# EAGLE design 8channelsULN2803 (EAGLE 6.1)
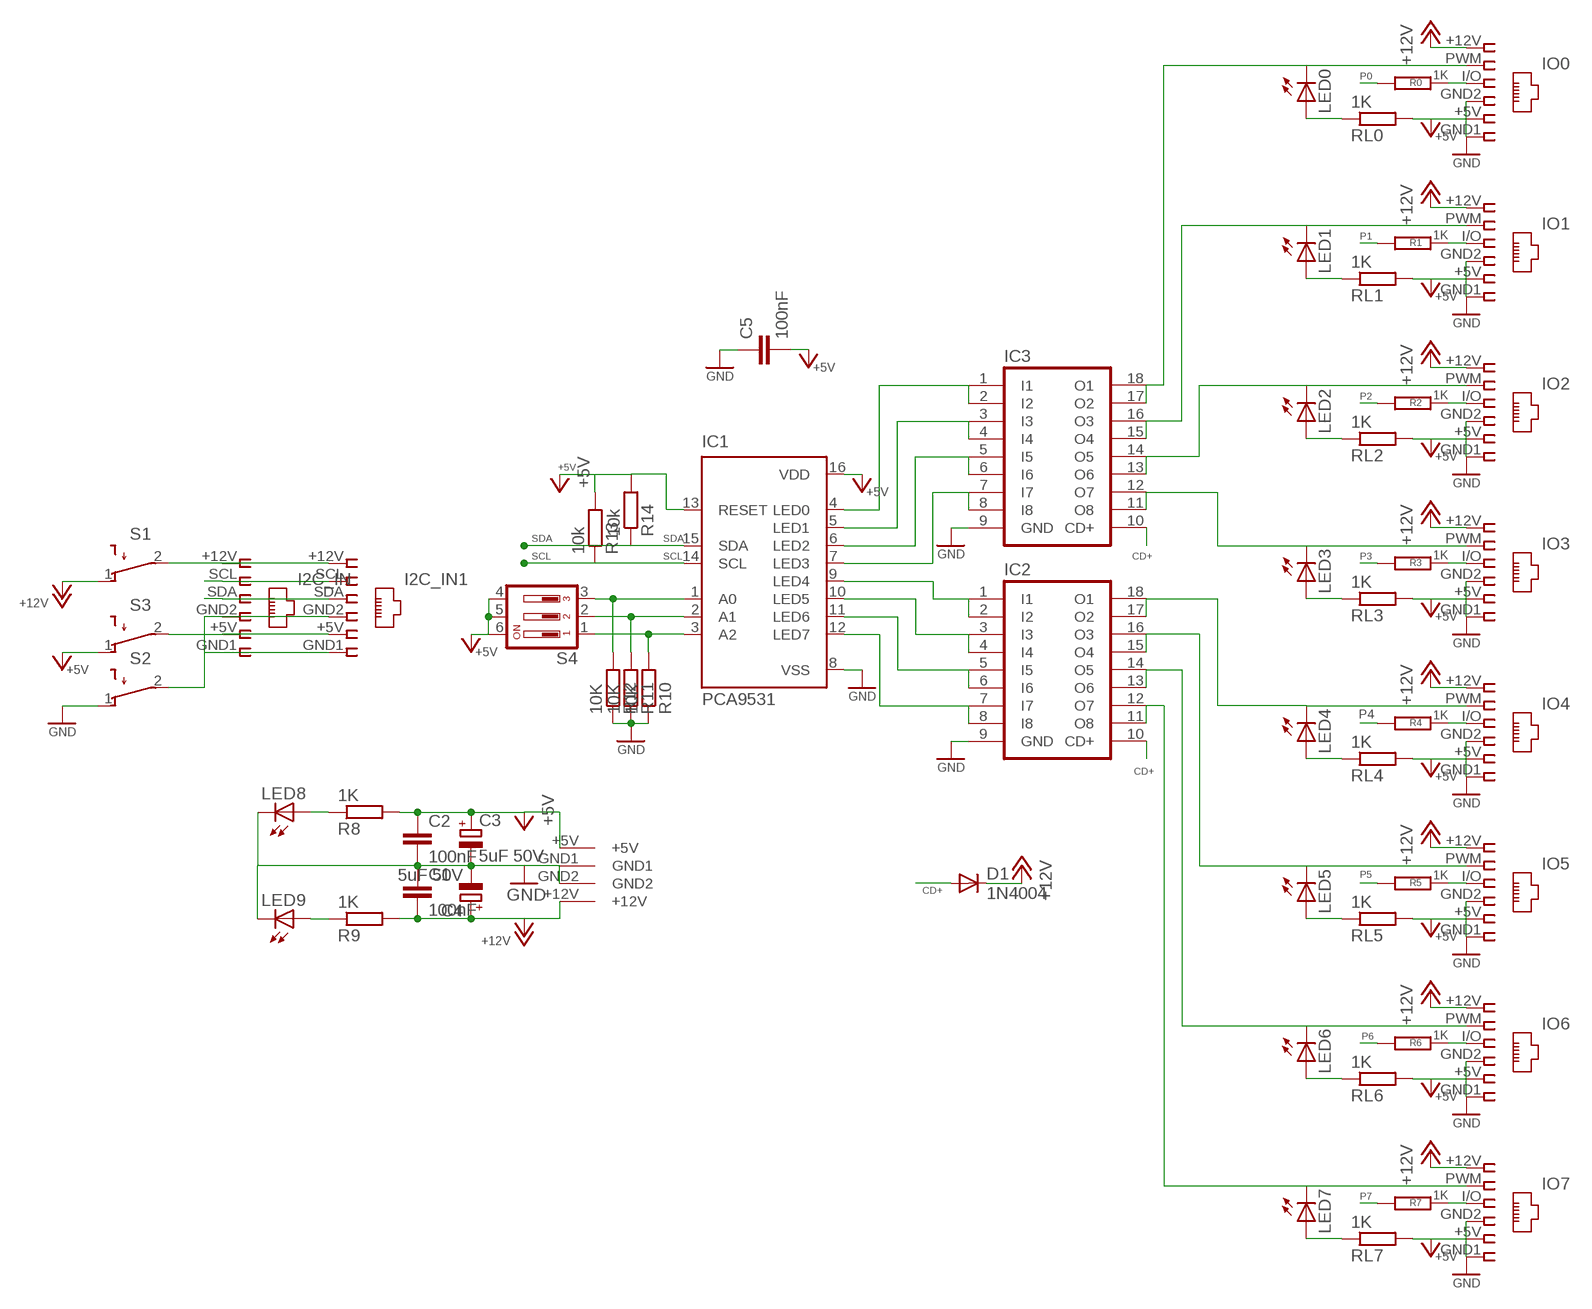
[diagram p0: schematic, sheet 1]

## Parts
C1  100nF  C-EUC1206  [C1206]
C2  100nF  C-EUC1206  [C1206]
C3  5uF 50V  CPOL-EUE3.5-8  [E3,5-8]
C4  5uF 50V  CPOL-EUE3.5-8  [E3,5-8]
C5  100nF  C-EUC1206  [C1206]
D1  1N4004  [DO41-10]
I2C_IN  I2C 1  RJ12STRAIGHT-I2C  [RJ12-STRAIGHT-I2C]
I2C_IN1  I2C 2  RJ12STRAIGHT-I2C  [RJ12-STRAIGHT-I2C]
IC1  PCA9531  [SO16]
IC2  ULN2803A  [DIL18]
IC3  ULN2803A  [DIL18]
IO0  IO0  RJ12STRAIGHT  [RJ12-STRAIGHT]
IO1  IO1  RJ12STRAIGHT  [RJ12-STRAIGHT]
IO2  IO2  RJ12STRAIGHT  [RJ12-STRAIGHT]
IO3  IO3  RJ12STRAIGHT  [RJ12-STRAIGHT]
IO4  IO4  RJ12STRAIGHT  [RJ12-STRAIGHT]
IO5  IO5  RJ12STRAIGHT  [RJ12-STRAIGHT]
IO6  IO6  RJ12STRAIGHT  [RJ12-STRAIGHT]
IO7  IO7  RJ12STRAIGHT  [RJ12-STRAIGHT]
LED0  LED3MM  [LED3MM]
LED1  LED3MM  [LED3MM]
LED2  LED3MM  [LED3MM]
LED3  LED3MM  [LED3MM]
LED4  LED3MM  [LED3MM]
LED5  LED3MM  [LED3MM]
LED6  LED3MM  [LED3MM]
LED7  LED3MM  [LED3MM]
LED8  LED3MM  [LED3MM]
LED9  LED3MM  [LED3MM]
R0  1K  R-EU_M1206  [M1206]
R1  1K  R-EU_M1206  [M1206]
R2  1K  R-EU_M1206  [M1206]
R3  1K  R-EU_M1206  [M1206]
R4  1K  R-EU_M1206  [M1206]
R5  1K  R-EU_M1206  [M1206]
R6  1K  R-EU_M1206  [M1206]
R7  1K  R-EU_M1206  [M1206]
R8  1K  R-EU_M1206  [M1206]
R9  1K  R-EU_M1206  [M1206]
R10  10K  R-EU_M1206  [M1206]
R11  10K  R-EU_M1206  [M1206]
R12  10K  R-EU_M1206  [M1206]
R13  10k  R-EU_M1206  [M1206]
R14  10k  R-EU_M1206  [M1206]
RL0  1K  R-EU_M1206  [M1206]
RL1  1K  R-EU_M1206  [M1206]
RL2  1K  R-EU_M1206  [M1206]
RL3  1K  R-EU_M1206  [M1206]
RL4  1K  R-EU_M1206  [M1206]
RL5  1K  R-EU_M1206  [M1206]
RL6  1K  R-EU_M1206  [M1206]
RL7  1K  R-EU_M1206  [M1206]
S1  SWITCHSWITCH  [SWITCH2]
S2  SWITCHPAD  [PADS2]
S3  SWITCHSWITCH  [SWITCH2]
S4  DIP03YL  [DIP03YL]
U$2  KPJX-4S-S  [KPJX-4S-S]

## Nets
+5V [highpower]: C2.1 C3.+ C5.2 IC1.13(RESET) IC1.16(VDD) IO0.+5V IO1.+5V IO2.+5V IO3.+5V IO4.+5V IO5.+5V IO6.+5V IO7.+5V R8.2 R13.2 R14.2 RL0.2 RL1.2 RL2.2 RL3.2 RL4.2 RL5.2 RL6.2 RL7.2 S3.1(O) S4.4 S4.5 S4.6 U$2.+5V
+12V [highpower]: C1.2 C4.+ D1.C IO0.+12V IO1.+12V IO2.+12V IO3.+12V IO4.+12V IO5.+12V IO6.+12V IO7.+12V R9.2 S1.1(O) U$2.+12V
CD+: D1.A IC2.10(CD+) IC3.10(CD+)
D2B: IO4.I/O R4.1
D2B1: IO5.I/O R5.1
D2B2: IO6.I/O R6.1
D2B3: IO7.I/O R7.1
D2B4: IO0.I/O R0.1
D2B5: IO1.I/O R1.1
D2B6: IO2.I/O R2.1
D2B7: IO3.I/O R3.1
GND [highpower]: C1.1 C2.2 C3.- C4.- C5.1 IC1.8(VSS) IC2.9(GND) IC3.9(GND) IO0.GND1 IO0.GND2 IO1.GND1 IO1.GND2 IO2.GND1 IO2.GND2 IO3.GND1 IO3.GND2 IO4.GND1 IO4.GND2 IO5.GND1 IO5.GND2 IO6.GND1 IO6.GND2 IO7.GND1 IO7.GND2 LED8.K(C) LED9.K(C) R10.1 R11.1 R12.1 S2.1(O) U$2.GND1 U$2.GND2
N$1 [power]: IC3.15(O4) IC3.16(O3) IO1.PWM LED1.K(C)
N$2: LED0.A RL0.1
N$3 [power]: IC3.17(O2) IC3.18(O1) IO0.PWM LED0.K(C)
N$4: LED1.A RL1.1
N$5 [highpower]: I2C_IN1.+12V I2C_IN.+12V S1.2(P)
N$6 [power]: IC2.13(O6) IC2.14(O5) IO6.PWM LED6.K(C)
N$7 [highpower]: I2C_IN1.+5V I2C_IN.+5V S3.2(P)
N$8 [power]: IC2.17(O2) IC2.18(O1) IO4.PWM LED4.K(C)
N$9 [power]: IC3.11(O8) IC3.12(O7) IO3.PWM LED3.K(C)
N$10 [highpower]: I2C_IN1.GND1 I2C_IN1.GND2 I2C_IN.GND1 I2C_IN.GND2 S2.2(P)
N$12: LED5.A RL5.1
N$13: LED9.A R9.1
N$15: LED4.A RL4.1
N$16: IC1.1(A0) R12.2 S4.3
N$17: IC1.2(A1) R11.2 S4.2
N$18: IC1.3(A2) R10.2 S4.1
N$21: LED6.A RL6.1
N$23: LED8.A R8.1
N$28: LED7.A RL7.1
N$38: LED2.A RL2.1
N$40 [power]: IC3.13(O6) IC3.14(O5) IO2.PWM LED2.K(C)
N$41: LED3.A RL3.1
N$42 [power]: IC2.15(O4) IC2.16(O3) IO5.PWM LED5.K(C)
N$44 [power]: IC2.11(O8) IC2.12(O7) IO7.PWM LED7.K(C)
P0: IC1.4(LED0) IC3.1(I1) IC3.2(I2) R0.2
P1: IC1.5(LED1) IC3.3(I3) IC3.4(I4) R1.2
P2: IC1.6(LED2) IC3.5(I5) IC3.6(I6) R2.2
P3: IC1.7(LED3) IC3.7(I7) IC3.8(I8) R3.2
P4: IC1.9(LED4) IC2.1(I1) IC2.2(I2) R4.2
P5: IC1.10(LED5) IC2.3(I3) IC2.4(I4) R5.2
P6: IC1.11(LED6) IC2.5(I5) IC2.6(I6) R6.2
P7: IC1.12(LED7) IC2.7(I7) IC2.8(I8) R7.2
SCL: I2C_IN1.SCL I2C_IN.SCL IC1.14(SCL) R13.1
SDA: I2C_IN1.SDA I2C_IN.SDA IC1.15(SDA) R14.1

## Library data of the parts
C1 C2 C5 = rcl:C-EU: CAPACITOR, European symbol
C3 C4 = rcl:CPOL-EU: POLARIZED CAPACITOR, European symbol
D1 = diode:1N4004: DIODE general purpose rectifier, 1 A
I2C_IN I2C_IN1 IO0 IO1-IO7 = lpatiny:RJ12: CORCOM Modular RJ Jacks No Shield Source: www.tycoelectronics.com .. ENG_DS_1654001_1099_RJ_L_0507.pdf
IC1 = lpatiny:PCA9531: I2C-Bus 8-bit LED dimmer r http://www.nxp.com/documents/data_sheet/PCA9531.pdf
IC2 IC3 = uln-udn:ULN2803A: DRIVER ARRAY
LED0 LED1-LED9 = lpatiny:LED3MM
R0 R1-R14 RL0 RL1-RL7 = resistor:R-EU_: RESISTOR, European symbol
S1-S3 = lpatiny:SWITCH: TOGGLE SWITCH
S4 = switch-dil:DIP03YL: DIL/CODE SWITCH; OC_FARNELL: unknown; OC_NEWARK: unknown
U$2 = lpatiny:KPJX-4S-S

## Net classes
0 default: width 0.457 mm
1 power: width 0.914 mm
2 highpower: width 1.372 mm

## Board
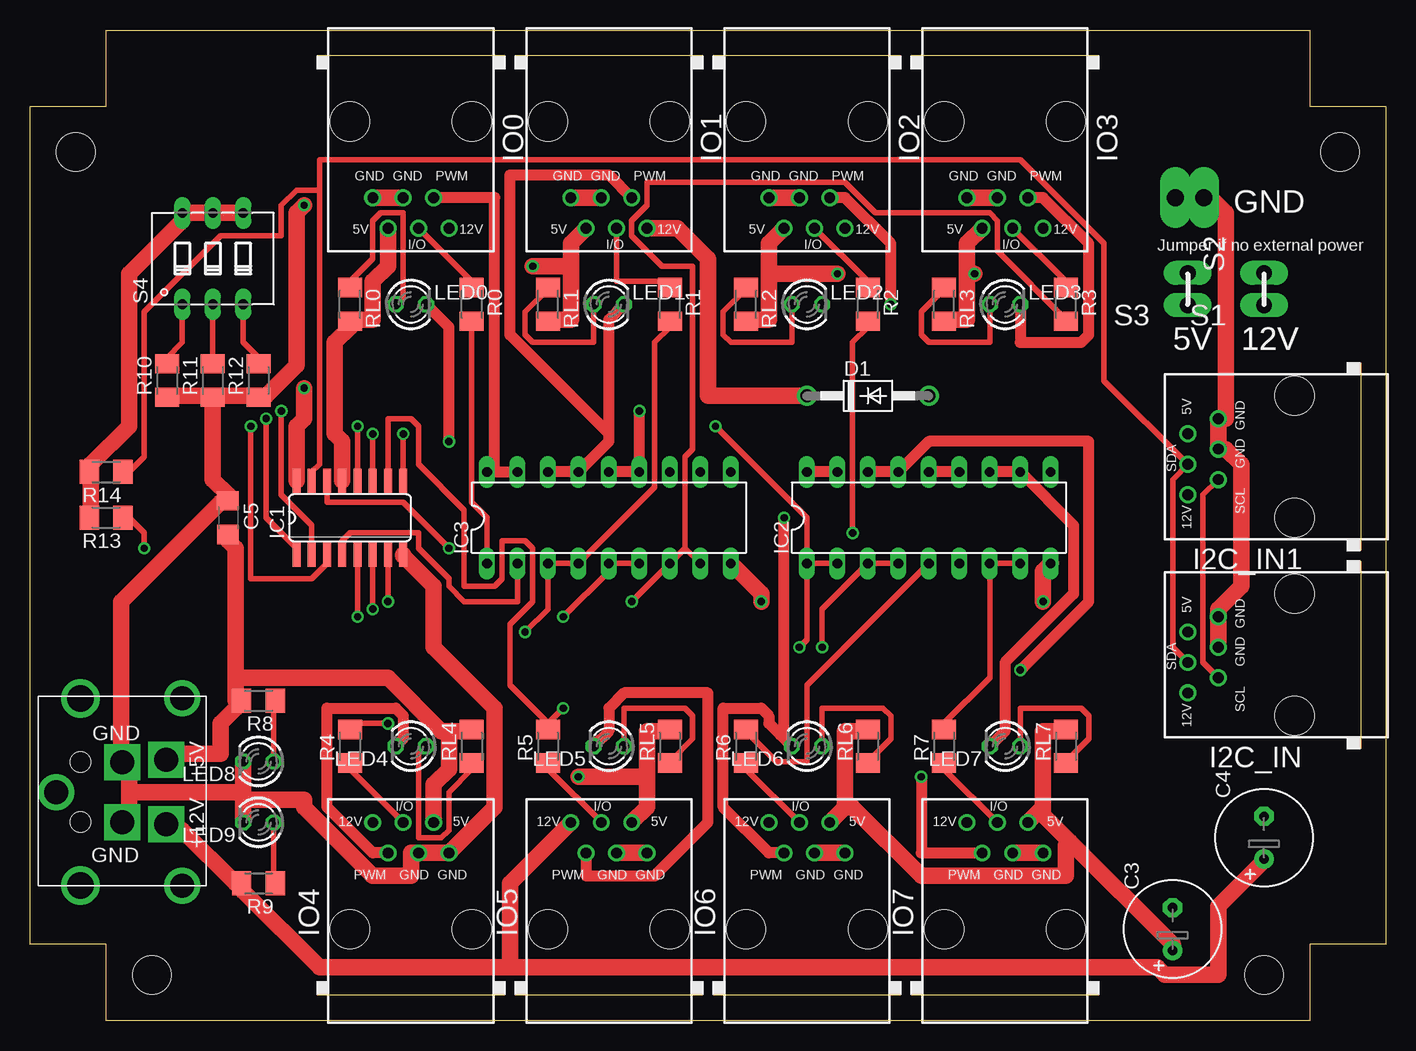
[diagram p1: board, top side]
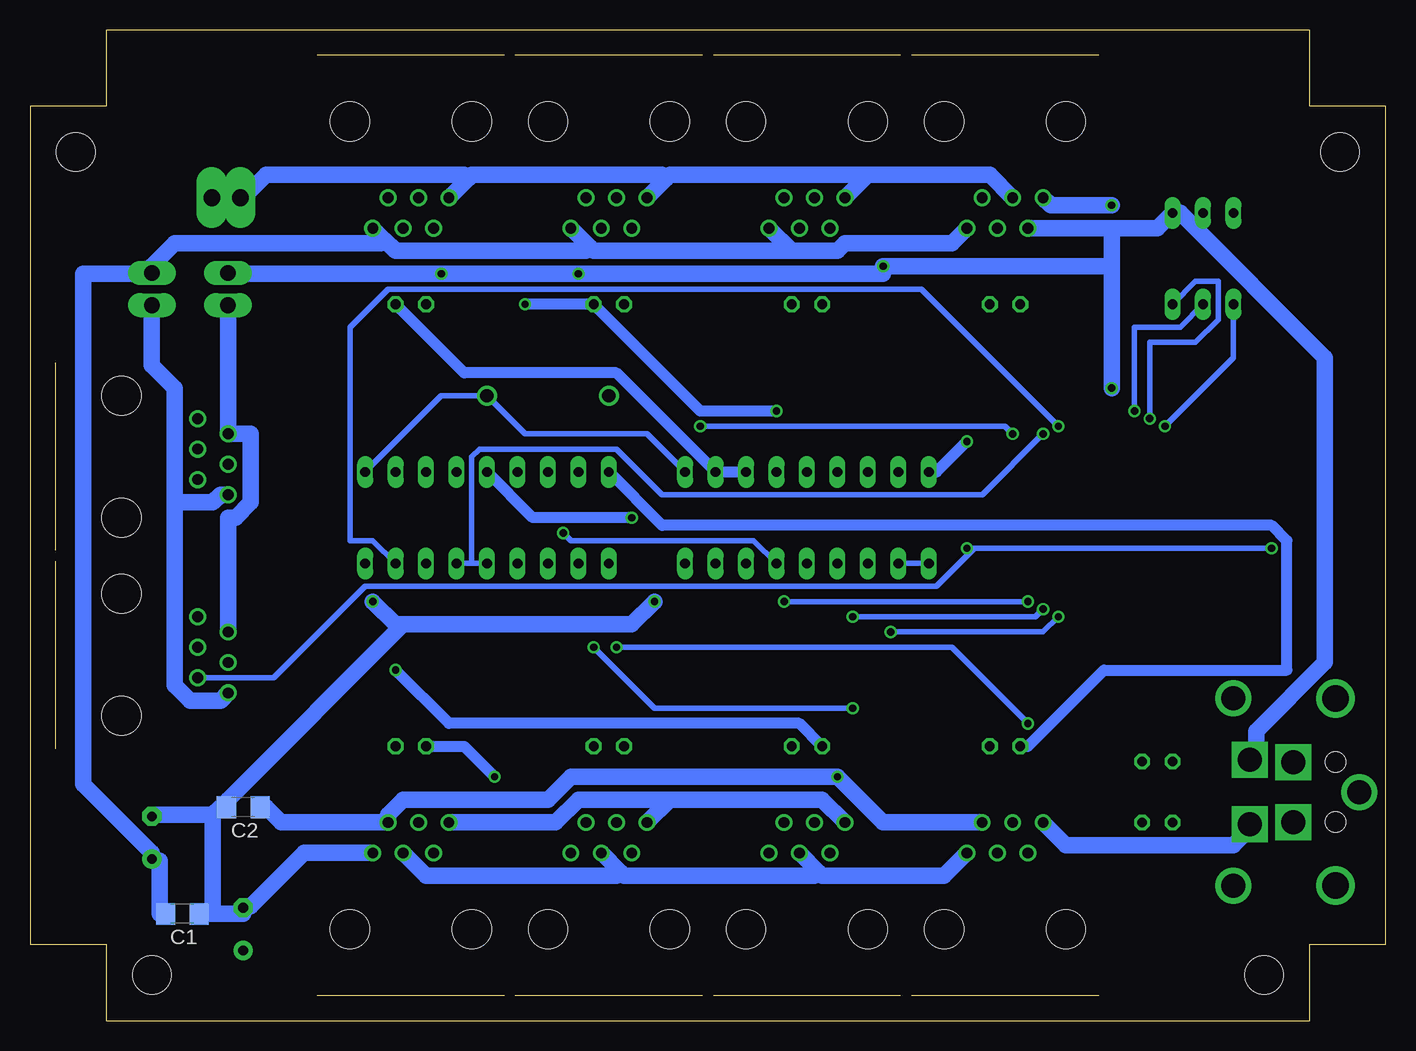
[diagram p2: board, bottom side, seen from below]

Size 113.03 x 82.55 mm. Coordinates in mm from the lower left corner, seen from the top.
Outline: 0,76.2 6.35,76.2 6.35,82.55 106.68,82.55 106.68,76.2 113.03,76.2 113.03,6.35 106.68,6.35 106.68,0 6.35,0 6.35,6.35 0,6.35 0,76.2
Copper layers (1*16): Top 0.035mm / dielectric 1.5mm / Bottom 0.035mm
Design rules: minimum track width 10mil, minimum drill 24mil, track to track 8mil, track to pad 8mil, pad to pad 8mil, via to via 8mil, smd to smd 8mil, copper to edge 40mil, drill to drill 8mil, minimum pad ring 10mil, minimum via ring 8mil, stop-mask expansion 4mil, vias tented up to drill 0mil, thermal gap 10mil
Holes 3.2 mm at 3.81,72.39 10.16,3.81 102.87,3.81 109.22,72.39
vRestrict: area 20.3,35.6 to 34.3,48.3
Milling: 12 lines

### Footprints (pad centres in the part's own frame; a part is rotated, then mirrored left to right if it is on the bottom)
C1206 = smd 1.6 x 1.8: 1 -1.4,0; 2 1.4,0
E3,5-8 = drill 0.813 pad 1.6: + -1.778,0 | drill 0.813 pad 1.6 octagon: - 1.778,0
DO41-10 = drill 1.118: A 5.08,0; C -5.08,0
RJ12-STRAIGHT-I2C = drill 0.9 pad 1.4: +5V 1.905,8.89; +12V -3.175,8.89; GND1 3.175,6.35; GND2 0.635,6.35; SCL -1.905,6.35; SDA -0.635,8.89 | hole 3.251: -5.08,0; 5.08,0
SO16 = smd 0.66 x 2.032: 1 -4.445,-3.073; 2 -3.175,-3.073; 3 -1.905,-3.073; 4 -0.635,-3.073; 5 0.635,-3.073; 6 1.905,-3.073; 7 3.175,-3.073; 8 4.445,-3.073; 9 4.445,3.073; 10 3.175,3.073; 11 1.905,3.073; 12 0.635,3.073; 13 -0.635,3.073; 14 -1.905,3.073; 15 -3.175,3.073; 16 -4.445,3.073
DIL18 = drill 0.813 long: 1 -10.16,-3.81; 2 -7.62,-3.81; 3 -5.08,-3.81; 4 -2.54,-3.81; 5 0,-3.81; 6 2.54,-3.81; 7 5.08,-3.81; 8 7.62,-3.81; 9 10.16,-3.81; 10 10.16,3.81; 11 7.62,3.81; 12 5.08,3.81; 13 2.54,3.81; 14 0,3.81; 15 -2.54,3.81; 16 -5.08,3.81; 17 -7.62,3.81; 18 -10.16,3.81
RJ12-STRAIGHT = drill 0.9 pad 1.4: +5V 1.905,8.89; +12V -3.175,8.89; GND1 3.175,6.35; GND2 0.635,6.35; I/O -0.635,8.89; PWM -1.905,6.35 | hole 3.251: -5.08,0; 5.08,0
LED3MM = drill 0.813 octagon: A -1.27,0; K 1.27,0
M1206 = smd 1.6 x 2: 1 -1.4,0; 2 1.4,0
SWITCH2 = drill 1.3 pad 2 long: 1 0,-1.346; 2 0,1.346
PADS2 = drill 1.4 pad 2.54 long: 1 0,-1.029; 2 0,1.346
DIP03YL = drill 0.813 long: 1 -2.54,-3.81; 2 0,-3.81; 3 2.54,-3.81; 4 2.54,3.81; 5 0,3.81; 6 -2.54,3.81
KPJX-4S-S = drill 2 square: +5V 2.7,1.35; +12V -2.7,1.35; GND1 -2.5,5; GND2 2.5,5 | drill 2: P$1 -7.8,0; P$2 7.8,0; P$11 0,10.5 | drill 2.2: P$3 -7.8,8.5; P$4 7.8,8.5 | hole 1.7: -2.5,8.5; 2.5,8.5

### Placement (x,y rotation side)
C1  100.33,8.89 180 bottom
C2  95.25,17.78 180 bottom
C3  95.25,7.62 90 top
C4  102.87,15.24 90 top
C5  16.51,41.91 270 top
D1  69.85,52.07 0 top
I2C_IN  105.41,30.48 90 top
I2C_IN1  105.41,46.99 90 top
IC1  26.67,41.91 0 top
IC2  74.93,41.91 0 top
IC3  48.26,41.91 0 top
IO0  31.75,74.93 180 top
IO1  48.26,74.93 180 top
IO2  64.77,74.93 180 top
IO3  81.28,74.93 180 top
IO4  31.75,7.62 0 top
IO5  48.26,7.62 0 top
IO6  64.77,7.62 0 top
IO7  81.28,7.62 0 top
LED0  31.75,59.69 0 top
LED1  48.26,59.69 0 top
LED2  64.77,59.69 0 top
LED3  81.28,59.69 0 top
LED4  31.75,22.86 180 top
LED5  48.26,22.86 180 top
LED6  64.77,22.86 180 top
LED7  81.28,22.86 180 top
LED8  19.05,21.59 180 top
LED9  19.05,16.51 180 top
R0  36.83,59.69 270 top
R1  53.34,59.69 270 top
R2  69.85,59.69 270 top
R3  86.36,59.69 270 top
R4  26.67,22.86 90 top
R5  43.18,22.86 90 top
R6  59.69,22.86 90 top
R7  76.2,22.86 90 top
R8  19.05,26.67 180 top
R9  19.05,11.43 180 top
R10  11.43,53.34 90 top
R11  15.24,53.34 90 top
R12  19.05,53.34 90 top
R13  6.35,41.91 180 top
R14  6.35,45.72 180 top
RL0  26.67,59.69 270 top
RL1  43.18,59.69 270 top
RL2  59.69,59.69 270 top
RL3  76.2,59.69 270 top
RL4  36.83,22.86 90 top
RL5  53.34,22.86 90 top
RL6  69.85,22.86 90 top
RL7  86.36,22.86 90 top
S1  102.87,60.96 180 top
S2  96.52,68.58 270 top
S3  96.52,60.96 180 top
S4  15.24,63.5 0 top
U$2  12.7,19.05 90 top

### Tracks (layer width: path | path; a pad name or v marks a point on that pad's centre or on a via)
+5V  (via drill 0.61)
  Top 1.372: 61.6,62.23 61.6,64.77 IO2.+5V | 61.6,62.23 61.6,58.42 59.69,58.42 RL2.2 | 78.1,62.23 78.1,64.77 IO3.+5V | 78.1,62.23 78.1,58.42 76.2,58.42 RL3.2 | v78.74,62.23 78.1,62.23 | v67.31,62.23 61.6,62.23 | R13.2 5.08,41.91 5.08,45.72 R14.2 5.08,46.35 8.26,49.53 8.26,62.23 12.7,66.67 S4.6 S4.5 S4.4 | 45.09,62.87 45.09,64.77 IO1.+5V | 45.09,62.87 45.09,58.42 43.18,58.42 RL1.2 | IO0.+5V 29.84,62.87 28.57,61.59 28.57,58.42 26.67,58.42 RL0.2 26.67,57.78 25.4,56.52 25.4,48.9 26.04,48.26 IC1.13 | IC1.16 22.22,49.53 22.86,50.16 v22.86,52.7 | v41.91,62.87 45.09,62.87 | 67.94,17.78 67.94,24.13 69.85,24.13 RL6.2 | IO6.+5V 67.94,17.78 | 84.45,17.78 84.45,24.13 86.36,24.13 RL7.2 | IO7.+5V 84.45,17.78 | 86.68,14.92 84.45,17.14 84.45,17.78 | 86.68,14.92 95.25,6.35 C3.+ | 67.94,17.78 68.58,17.78 74.3,12.06 86.36,12.06 86.36,14.61 86.68,14.92 | 51.44,20.32 51.44,17.78 IO5.+5V | 51.44,20.32 51.44,24.13 53.34,24.13 RL5.2 | 34.93,24.13 36.83,24.13 RL4.2 | 34.93,24.13 34.93,20.95 33.66,19.68 IO4.+5V | 17.14,28.57 17.14,26.67 R8.2 17.14,26.04 15.88,24.77 15.88,22.23 11.43,22.23 U$2.+5V | 17.14,28.57 17.14,39.37 16.51,40.01 C5.2 | 17.14,28.57 29.84,28.57 34.29,24.13 34.93,24.13 | v45.72,20.32 51.44,20.32
  Bottom 1.372: S3.1 96.52,62.23 v78.74,62.23 v67.31,62.23 41.91,62.23 v41.91,62.87 22.86,62.87 | 22.86,66.04 22.86,62.87 | 22.86,62.87 v22.86,52.7 | IO0.+5V 22.86,66.04 | 22.86,66.04 19.05,66.04 S4.4 17.14,67.31 5.08,55.24 5.08,29.84 10.79,24.13 10.79,22.23 U$2.+5V | C2.1 93.34,17.78 92.08,16.51 IO7.+5V 83.19,17.14 81.91,18.41 69.85,18.41 67.94,20.32 v45.72,20.32 41.91,16.51 IO4.+5V
+12V
  Top 1.372: U$2.+12V 11.43,15.88 12.7,15.88 17.14,11.43 R9.2 17.78,10.79 24.13,4.45 40.01,4.45 | 40.01,4.45 40.01,11.43 IO5.+12V | D1.C 56.52,52.07 56.52,63.5 53.98,66.04 IO1.+12V | 40.01,4.45 93.98,4.45 94.61,3.81 99.06,3.81 99.06,9.53 102.87,13.34 C4.+
  Bottom 1.372: IO4.+12V 26.67,14.61 12.7,14.61 11.43,15.88 U$2.+12V | IO5.+12V 46.99,18.41 59.69,18.41 | IO6.+12V 59.69,18.41 | IO7.+12V 69.21,16.51 67.31,18.41 59.69,18.41 | C1.2 102.23,8.89 102.23,13.34 102.87,13.34 C4.+ 102.87,13.97 108.58,19.68 108.58,62.23 103.5,62.23 S1.1 102.87,62.87 100.96,64.77 83.82,64.77 83.5,65.09 | IO0.+12V 36.2,64.77 45.09,64.77 45.72,64.14 49.53,64.14 | IO1.+12V 49.53,64.14 | 66.36,64.45 66.04,64.14 49.53,64.14 | 66.36,64.45 IO2.+12V | 83.5,65.09 82.55,64.14 66.67,64.14 66.36,64.45 | 83.5,65.09 IO3.+12V
CD+
  Bottom 0.457: IC3.10 61.6,48.9 71.75,48.9 D1.A 78.74,52.07 IC2.10
D2B
  Top 0.457: IO4.I/O 26.67,20.95 R4.1
D2B1
  Top 0.457: IO5.I/O 43.18,20.95 R5.1
D2B2
  Top 0.457: IO6.I/O 59.69,20.95 R6.1
D2B3
  Top 0.457: IO7.I/O 76.2,20.95 R7.1
D2B4
  Top 0.457: IO0.I/O 36.83,61.59 R0.1
D2B5
  Top 0.457: IO1.I/O 48.9,61.59 53.34,61.59 R1.1
D2B6
  Top 0.457: IO2.I/O 69.85,61.59 R2.1
D2B7
  Top 0.457: IO3.I/O 86.36,61.59 R3.1
GND  (via drill 0.61)
  Top 1.372: IC3.9 60.96,35.56 v60.96,34.92 | IC2.9 84.45,37.47 v84.45,34.92 | IO3.GND2 IO3.GND1 | IO2.GND2 IO2.GND1 | IO0.GND2 IO0.GND1 | IO1.GND2 IO1.GND1 | R11.1 15.24,45.09 16.51,43.81 C5.1 15.88,43.18 7.62,34.92 7.62,22.23 U$2.GND2 8.26,20.95 8.26,19.05 | R10.1 11.43,52.07 14.61,52.07 R11.1 | R11.1 15.88,52.07 19.05,52.07 R12.1 19.68,52.07 22.22,54.61 22.22,67.31 v22.86,67.94 | LED8.K 17.78,19.05 | 17.78,19.05 17.78,18.41 | 17.78,18.41 LED9.K | 8.26,19.05 17.78,19.05 | 8.26,19.05 8.26,17.14 U$2.GND1 | IO7.GND1 IO7.GND2 | IO6.GND1 IO6.GND2 | IO5.GND1 IO5.GND2 | IC1.8 31.11,38.73 33.66,36.2 33.66,31.11 38.74,26.04 38.74,17.78 IO4.GND1 IO4.GND2 31.75,13.97 31.75,12.06 28.57,12.06 22.86,17.78 22.86,18.41 17.78,18.41
  Bottom 1.372: 97.79,8.89 95.25,8.89 C3.- 94.61,9.53 90.17,13.97 IO7.GND1 | 97.79,8.89 C1.1 | 97.79,17.14 97.16,17.78 C2.2 96.52,18.41 81.91,33.02 | 97.79,17.14 102.87,17.14 C4.- | v60.96,34.92 62.87,33.02 81.91,33.02 | v84.45,34.92 82.55,33.02 81.91,33.02 | 97.79,17.14 97.79,8.89 | IO0.GND2 33.02,70.48 43.18,70.48 | IO1.GND1 43.18,70.48 | 60.01,70.17 59.69,70.48 43.18,70.48 | 60.01,70.17 IO2.GND1 | 76.52,70.17 76.2,70.48 60.33,70.48 60.01,70.17 | 76.52,70.17 IO3.GND1 | S2.1 95.25,68.58 93.34,70.48 76.83,70.48 76.52,70.17 | 47.31,12.38 46.99,12.06 36.83,12.06 IO4.GND1 | 47.31,12.38 IO5.GND2 | 63.82,12.38 63.5,12.06 47.62,12.06 47.31,12.38 | 63.82,12.38 IO6.GND2 | IO7.GND2 80.01,12.06 64.14,12.06 63.82,12.38 | IO0.GND1 27.94,67.94 v22.86,67.94
N$1
  Top 0.914: IC3.16 IC3.15 48.26,48.26 48.26,48.9 | LED1.K 48.26,58.42 48.26,48.9 | IO1.PWM 48.26,70.48 40.01,70.48 40.01,57.15 48.26,48.9
N$2
  Top 0.457: LED0.A 31.11,60.33 31.11,67.31 29.21,67.31 28.57,66.67 28.57,63.5 26.67,61.59 RL0.1
N$3  (via drill 0.61)
  Top 0.914: LED0.K 34.93,57.78 v34.93,48.26 | 38.74,45.72 IC3.17 | IO0.PWM 38.74,68.58 38.74,45.72 | 38.74,45.72 IC3.18
  Bottom 0.914: v34.93,48.26 37.47,45.72 IC3.18
N$4
  Top 0.457: LED1.A 46.99,56.52 41.91,56.52 41.28,57.15 41.28,59.05 43.18,60.96 RL1.1
N$5
  Bottom 1.372: I2C_IN.+12V 97.16,26.67 99.69,26.67 100.96,27.94 100.96,43.18 | 100.96,43.18 97.79,43.18 97.16,43.81 I2C_IN1.+12V | S1.2 102.87,54.61 100.96,52.7 100.96,43.18
N$6  (via drill 0.61)
  Top 0.914: IC2.13 IC2.14 | 62.55,23.81 61.6,24.77 61.6,25.4 60.96,26.04 57.79,26.04 57.79,17.78 61.6,13.97 IO6.PWM | 62.55,23.81 LED6.K | v62.87,41.91 62.87,24.13 62.55,23.81
  Bottom 0.914: IC2.14 71.12,41.91 v62.87,41.91
N$7
  Bottom 1.372: I2C_IN.+5V 96.52,41.91 95.88,41.91 94.61,43.18 94.61,48.9 I2C_IN1.+5V S3.2
N$8
  Top 0.914: IC2.17 IC2.18 | LED4.K 31.11,23.5 31.11,25.4 30.48,26.04 24.77,26.04 24.77,17.78 28.57,13.97 IO4.PWM
  Bottom 0.914: IC2.18 60.33,41.27 9.53,41.27 8.26,40.01 8.26,29.21 23.5,29.21 29.84,22.86 LED4.K
N$9
  Top 0.914: IO3.PWM 84.45,68.58 88.27,64.77 88.27,57.15 87.63,56.52 82.55,56.52 LED3.K
  Bottom 0.914: IC3.12 IC3.11 64.14,53.98 76.83,53.98 LED3.K
N$10
  Top 1.372: I2C_IN.GND2 I2C_IN.GND1 99.06,34.29 100.96,36.2 100.96,46.35 99.69,47.62 I2C_IN1.GND2 I2C_IN1.GND1 99.69,50.16 99.69,67.31 98.42,68.58 S2.2
N$12
  Top 0.457: LED5.A 49.53,26.04 54.61,26.04 55.25,25.4 55.25,23.5 53.34,21.59 RL5.1
N$13
  Top 0.457: LED9.A 20.32,11.43 R9.1
N$15
  Top 0.457: LED4.A 32.38,22.23 32.38,15.24 34.29,15.24 34.93,15.88 34.93,19.05 36.83,20.95 RL4.1
N$16  (via drill 0.61)
  Top 0.457: S4.3 17.78,56.52 19.05,55.24 R12.2 | v19.68,50.16 19.68,41.91 22.22,39.37 IC1.1
  Bottom 0.457: v19.68,50.16 19.68,56.52 15.88,56.52 13.97,58.42 13.97,61.59 15.88,61.59 S4.3
N$17  (via drill 0.61)
  Top 0.457: S4.2 R11.2 | IC1.2 23.5,41.27 20.95,43.81 v20.95,50.8
  Bottom 0.457: v20.95,50.8 20.95,57.78 17.14,57.78 S4.2
N$18  (via drill 0.61)
  Top 0.457: S4.1 12.7,56.52 11.43,55.24 R10.2 | IC1.3 24.77,38.1 23.5,36.83 18.41,36.83 v18.41,49.53
  Bottom 0.457: v18.41,49.53 12.7,55.24 S4.1
N$21
  Top 0.457: LED6.A 66.04,26.04 71.12,26.04 71.75,25.4 71.75,23.5 69.85,21.59 RL6.1
N$23
  Top 0.457: LED8.A 20.32,26.67 R8.1
N$28
  Top 0.457: LED7.A 82.55,26.04 87.63,26.04 88.27,25.4 88.27,23.5 86.36,21.59 RL7.1
N$38
  Top 0.457: LED2.A 63.5,56.52 58.42,56.52 57.79,57.15 57.79,59.05 59.69,60.96 RL2.1
N$40  (via drill 0.61)
  Top 0.914: IC3.14 IC3.13 v50.8,50.8 | IO2.PWM 67.94,68.58 71.75,64.77 v71.75,59.69
  Bottom 0.914: v50.8,50.8 57.15,50.8 LED2.K v71.75,59.69
N$41
  Top 0.457: LED3.A 80.01,56.52 74.93,56.52 74.3,57.15 74.3,59.05 76.2,60.96 RL3.1
N$42  (via drill 0.61)
  Top 0.914: IC2.16 IC2.15 74.93,48.26 88.27,48.26 88.27,34.92 v82.55,29.21 | LED5.K 48.26,24.13 48.26,26.04 49.53,27.3 56.52,27.3 56.52,16.51 52.07,12.06 46.36,12.06 IO5.PWM
  Bottom 0.914: v82.55,29.21 78.1,24.77 48.9,24.77 LED5.K
N$44  (via drill 0.61)
  Top 0.914: LED7.K 81.28,24.13 81.28,29.84 86.99,35.56 86.99,41.27 IC2.11 IC2.12 | IO7.PWM 74.3,13.97 v74.3,20.32
  Bottom 0.914: v74.3,20.32 76.83,22.86 LED7.K
P0
  Top 0.457: IC1.4 26.04,40.01 26.67,40.64 32.38,40.64 32.38,39.37 34.93,36.83 34.93,36.2 36.2,34.92 40.64,34.92 IC3.2 | R0.2 36.83,43.18 38.1,41.91 IC3.1
  Bottom 0.457: IC3.1 IC3.2
P1  (via drill 0.61)
  Top 0.457: v27.3,33.66 IC1.5 | v41.28,32.38 43.18,34.29 IC3.3 IC3.4 52.07,44.45 52.07,56.52 53.34,57.78 R1.2
  Bottom 0.457: v27.3,33.66 28.57,32.38 v41.28,32.38
P2  (via drill 0.61)
  Top 0.457: v28.57,34.29 IC1.6 | v44.45,33.66 48.26,37.47 IC3.5 IC3.6 | v68.58,40.64 68.58,56.52 69.85,57.78 R2.2
  Bottom 0.457: v28.57,34.29 29.21,33.66 v44.45,33.66 | v68.58,40.64 67.94,40.01 52.71,40.01 IC3.6
P3  (via drill 0.61)
  Top 0.457: 54.61,39.37 54.61,46.99 55.25,47.62 55.25,62.87 52.71,62.87 50.17,65.41 50.17,66.67 51.44,67.94 51.44,69.85 67.94,69.85 70.48,67.31 80.01,67.31 80.64,66.67 80.64,64.14 86.36,58.42 R3.2 | 54.61,39.37 IC3.7 v50.17,34.92 | v29.84,34.92 IC1.7 | 54.61,39.37 IC3.8
  Bottom 0.457: v50.17,34.92 v29.84,34.92
P4  (via drill 0.61)
  Top 0.457: v29.84,24.77 26.67,24.77 R4.2 | v64.14,31.11 64.77,31.75 IC2.1 | v31.11,48.9 IC1.9 | v57.15,49.53 64.77,41.91 IC2.1 | IC2.1 IC2.2
  Bottom 0.457: v29.84,24.77 36.2,31.11 v64.14,31.11 | v31.11,48.9 31.75,49.53 v57.15,49.53
P5  (via drill 0.61)
  Top 0.457: IC2.4 IC2.3 66.04,34.29 v66.04,31.11 | 43.18,24.77 40.01,27.94 40.01,33.02 41.91,34.92 41.91,39.37 41.28,40.01 39.37,40.01 39.37,36.83 38.74,36.2 36.2,36.2 36.2,42.55 32.38,46.35 32.38,49.53 31.75,50.16 29.84,50.16 IC1.10 | 43.18,24.77 v44.45,26.04 | 43.18,24.77 R5.2
  Bottom 0.457: v66.04,31.11 60.96,26.04 v44.45,26.04
P6  (via drill 0.61)
  Top 0.457: IC2.5 64.77,27.94 64.77,21.59 62.23,21.59 59.69,24.13 R6.2 | v28.57,48.9 IC1.11
  Bottom 0.457: v28.57,48.9 33.66,43.81 60.33,43.81 64.14,47.62 75.56,47.62 76.2,46.99 76.2,38.1 | IC2.5 76.2,38.1 | 76.2,38.1 IC2.6
P7  (via drill 0.61)
  Top 0.457: R7.2 76.2,24.77 80.01,28.57 IC2.7 IC2.8 | v27.3,49.53 IC1.12
  Bottom 0.457: v27.3,49.53 38.74,60.96 83.19,60.96 86.36,57.78 86.36,40.01 84.45,40.01 IC2.8
SCL  (via drill 0.61)
  Top 0.457: I2C_IN.SCL 97.79,29.84 97.79,43.81 I2C_IN1.SCL | v9.53,39.37 9.53,40.64 8.26,41.91 R13.1 | v34.93,39.37 31.11,43.18 24.77,43.18 IC1.14
  Bottom 0.457: v34.93,39.37 34.29,39.37 | 34.29,39.37 v9.53,39.37 | I2C_IN.SCL 92.71,28.57 85.09,36.2 37.47,36.2 34.29,39.37
SDA
  Top 0.457: I2C_IN.SDA 95.25,31.11 95.25,45.09 I2C_IN1.SDA 89.53,53.34 89.53,64.77 82.55,71.75 24.13,71.75 24.13,69.22 | 24.13,69.22 22.22,69.22 20.95,67.94 20.95,65.41 15.88,65.41 9.53,59.05 9.53,46.99 8.26,45.72 R14.1 | 24.13,69.22 24.13,46.35 23.5,45.72 IC1.15

### Text on the board
tPlace: GND | Jumper if no external power | 5V | 12V | 12V